# Altium schematic sheet sensornode_v2.SchDoc
size A4; DocumentNumber: 1; SheetNumber: 1; SheetTotal: 7
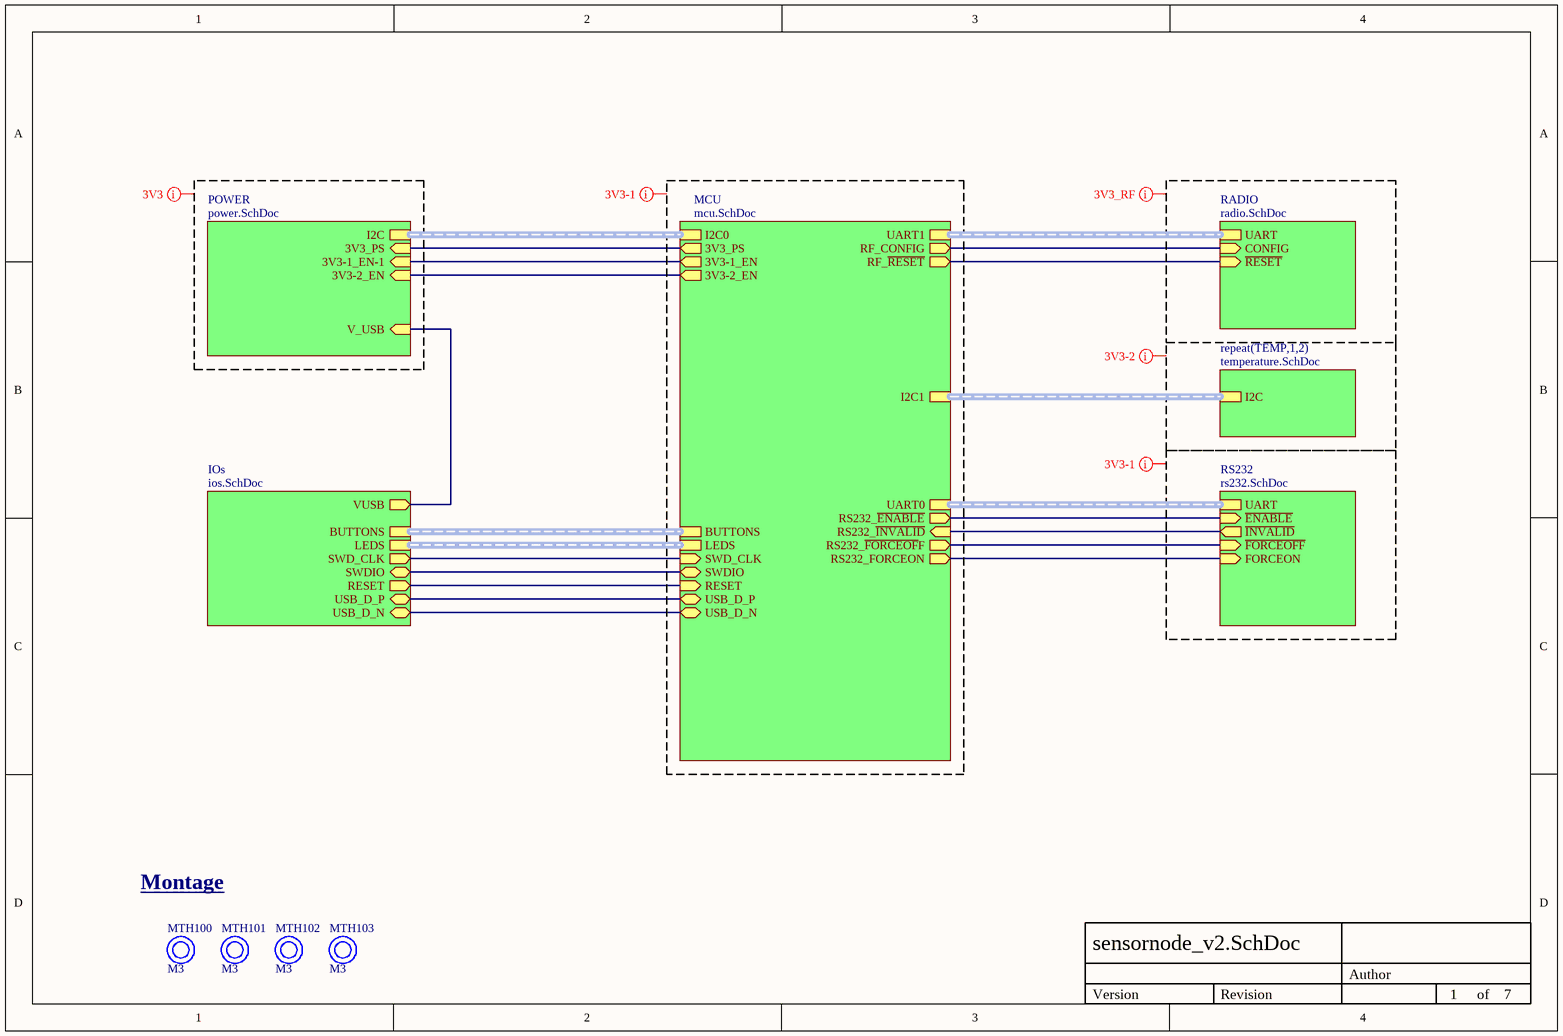
[diagram p0: sensornode_v2.SchDoc]

## Parts
MTH100  M3  (mechanical)
MTH101  M3  (mechanical)
MTH102  M3  (mechanical)
MTH103  M3  (mechanical)

## Sub-sheets
IOs = ios.SchDoc: RESET (out), USB_D_N (bidir), USB_D_P (bidir), LEDS (harness LED), BUTTONS (harness BUTTONS), SWDIO (bidir), SWD_CLK (out), VUSB (out)
MCU = mcu.SchDoc: I2C0 (harness I2C0), UART1 (harness UART0), UART0 (harness UART1), I2C1 (harness I2C1), RF_CONFIG (out), RF_~{RESET} (out), 3V3_PS (out), SWD_CLK (in), SWDIO (bidir), RESET (in), USB_D_N (bidir), USB_D_P (bidir), RS232_~{ENABLE} (out), RS232_~{INVALID} (in), BUTTONS (harness BUTTONS), LEDS (harness LED), 3V3-1_EN (out), 3V3-2_EN (out), RS232_~{FORCEOF}F (out), RS232_FORCEON (out)
POWER = power.SchDoc: 3V3_PS (in), I2C (harness I2C), V_USB (in), 3V3-2_EN (in), 3V3-1_EN-1 (in)
RADIO = radio.SchDoc: UART (harness UART), CONFIG (in), ~{RESET} (in)
repeat(TEMP,1,2) = temperature.SchDoc: I2C (harness I2C_Temp)
RS232 = rs232.SchDoc: UART (harness UART_RS232), ~{ENABLE} (in), ~{INVALID} (out), ~{FORCEOFF} (in), FORCEON (in)

## Nets
(unnamed): sheet MCU/RF_CONFIG, sheet RADIO/CONFIG
(unnamed): sheet MCU/RF_~{RESET}, sheet RADIO/~{RESET}
(unnamed): sheet MCU/3V3_PS, sheet POWER/3V3_PS
(unnamed): sheet MCU/SWD_CLK, sheet IOs/SWD_CLK
(unnamed): sheet MCU/SWDIO, sheet IOs/SWDIO
(unnamed): sheet MCU/RESET, sheet IOs/RESET
(unnamed): sheet MCU/USB_D_N, sheet IOs/USB_D_N
(unnamed): sheet MCU/USB_D_P, sheet IOs/USB_D_P
(unnamed): sheet MCU/RS232_~{ENABLE}, sheet RS232/~{ENABLE}
(unnamed): sheet MCU/RS232_~{INVALID}, sheet RS232/~{INVALID}
(unnamed): sheet MCU/3V3-1_EN, sheet POWER/3V3-1_EN-1
(unnamed): sheet MCU/3V3-2_EN, sheet POWER/3V3-2_EN
(unnamed): sheet MCU/RS232_~{FORCEOF}F, sheet RS232/~{FORCEOFF}
(unnamed): sheet MCU/RS232_FORCEON, sheet RS232/FORCEON
(unnamed): sheet POWER/V_USB, sheet IOs/VUSB

## Buses and harness runs
harness sheet IOs/BUTTONS = sheet MCU/BUTTONS
harness sheet IOs/LEDS = sheet MCU/LEDS
harness sheet MCU/I2C0 = sheet POWER/I2C
harness sheet MCU/I2C1 = sheet repeat(TEMP,1,2)/I2C
harness sheet MCU/UART0 = sheet RS232/UART
harness sheet MCU/UART1 = sheet RADIO/UART

## Layout directives
net class 3V3: (no net found under the mark)
net class 3V3-2: (no net found under the mark)
net class 3V3-1: (no net found under the mark)

## Notes on the sheet
- Montage
- Author
- Version
- Revision
- of

## Library data of the parts
MTH100-MTH103 = MOUNT_TH: Value: M3